# Altium schematic sheet Sheet1.SchDoc
size A3
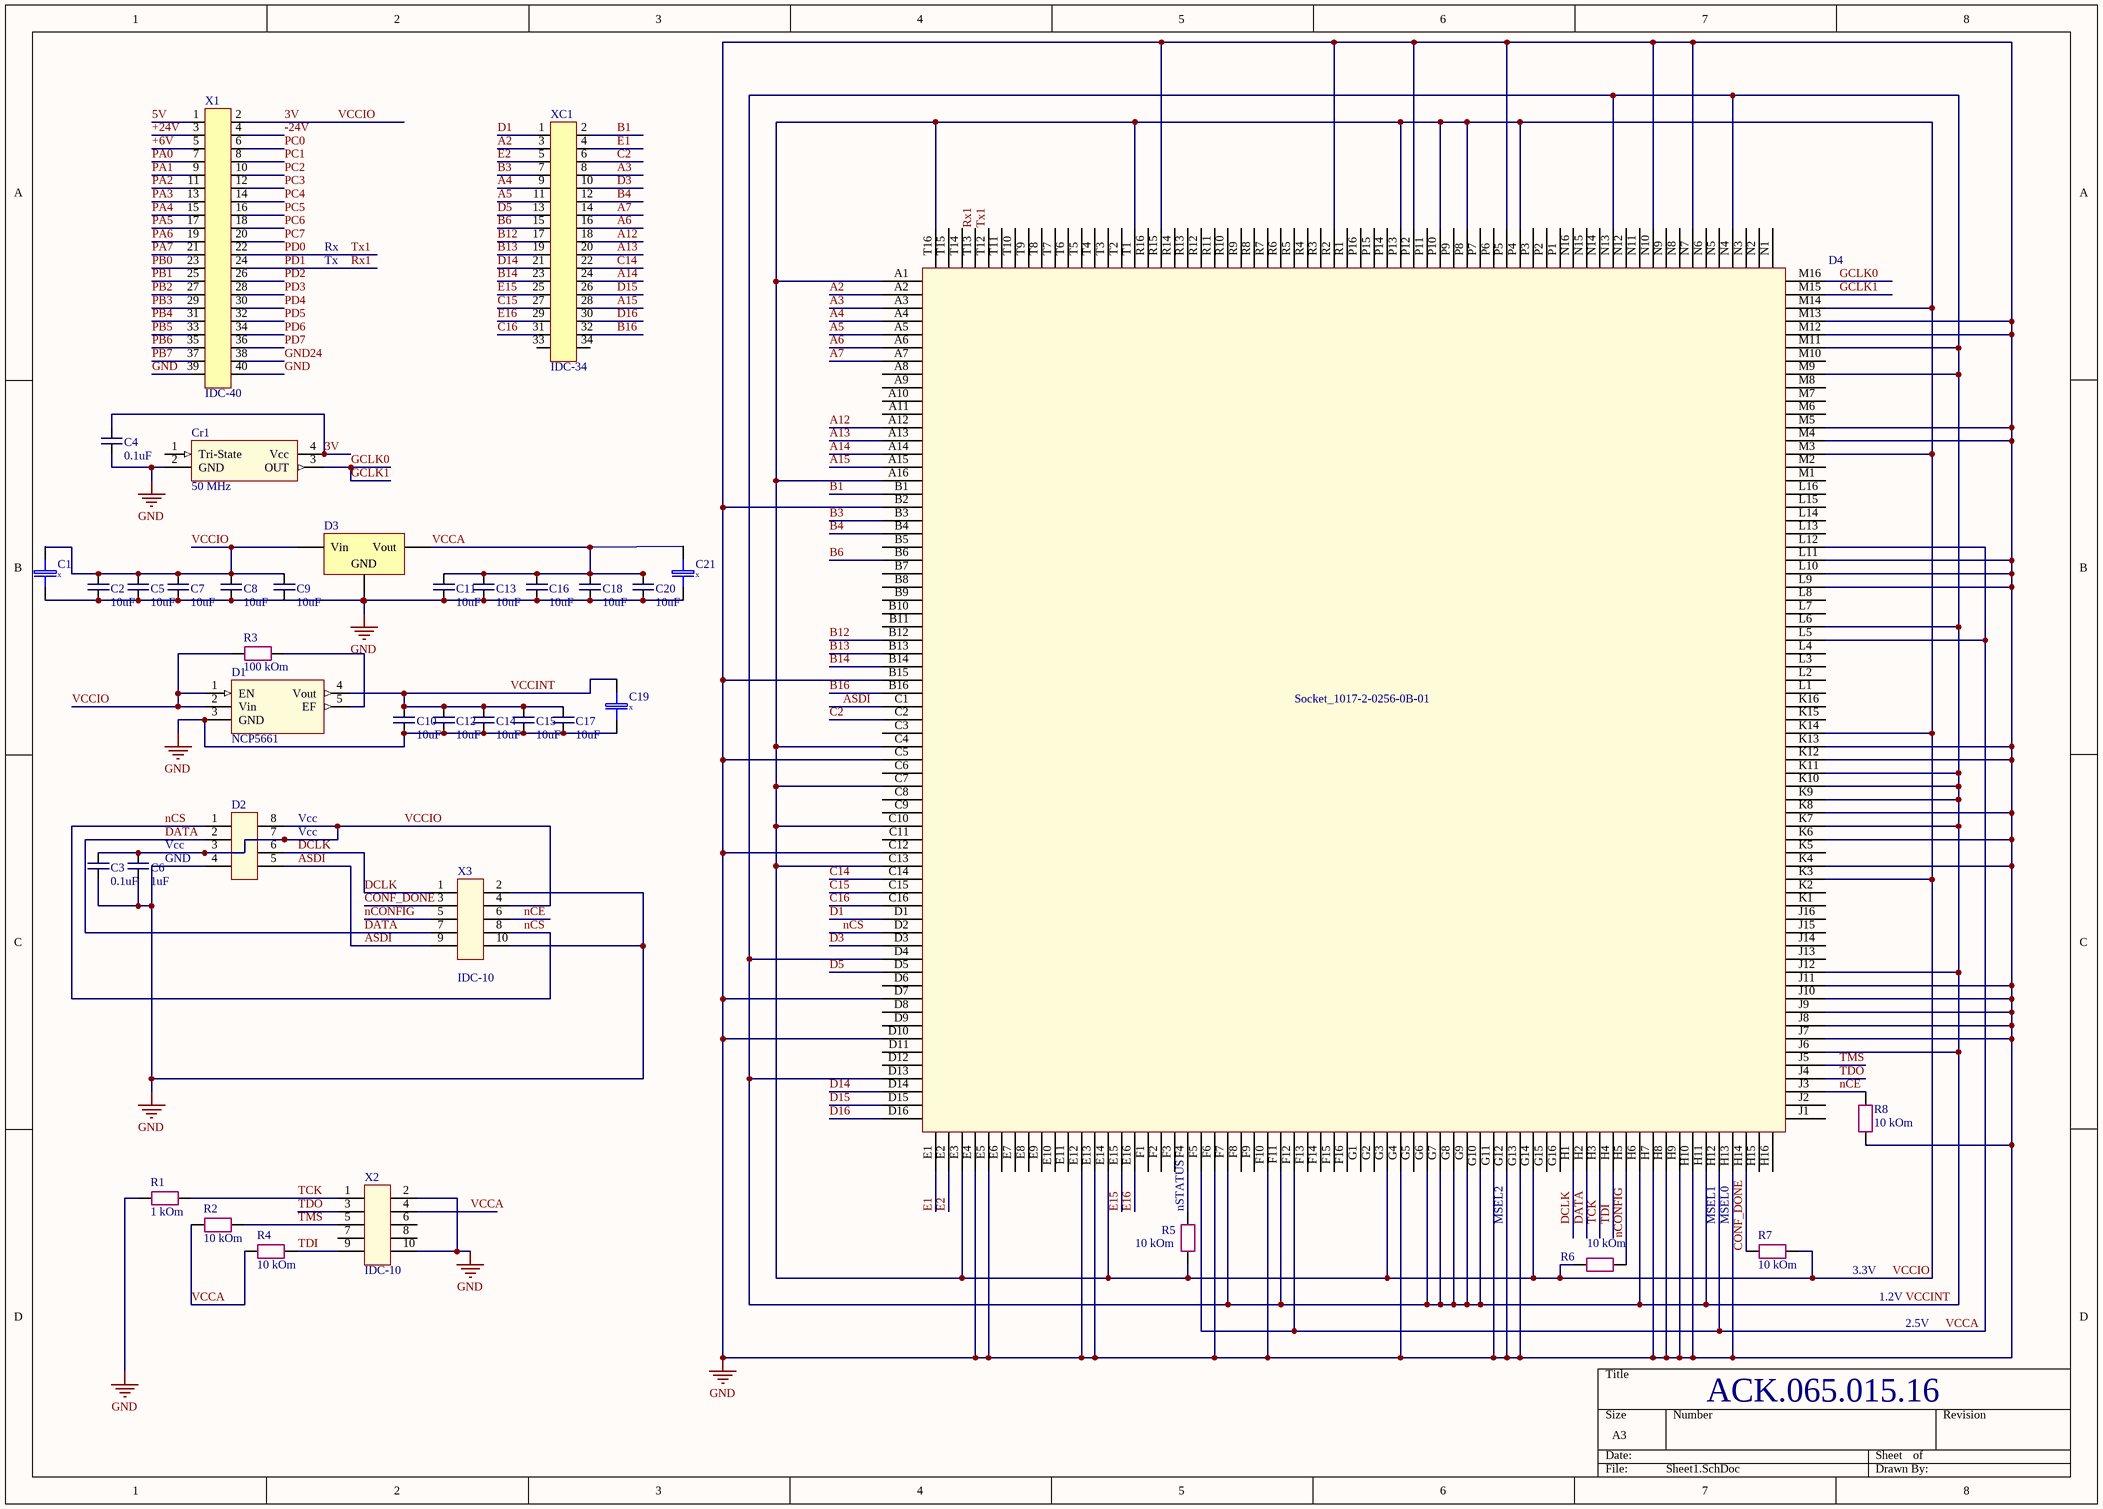
[diagram p0: Sheet1.SchDoc]

## Parts
C1  x  [EL Case D (7343-31)]
C2  10uF  [C_0805]
C3  0.1uF  [C_0805]
C4  0.1uF  [C_0805]
C5  10uF  [C_0805]
C6  1uF  [C_0805]
C7  10uF  [C_0805]
C8  10uF  [C_0805]
C9  10uF  [C_0805]
C10  10uF  [C_0805]
C11  10uF  [C_0805]
C12  10uF  [C_0805]
C13  10uF  [C_0805]
C14  10uF  [C_0805]
C15  10uF  [C_0805]
C16  10uF  [C_0805]
C17  10uF  [C_0805]
C18  10uF  [C_0805]
C19  x  [EL Case D (7343-31)]
C20  10uF  [C_0805]
C21  x  [EL Case D (7343-31)]
Cr1  50 MHz  [quartz gen smd 5032]
D1  NCP5661  [TO114P990-5_6M]
D2  SOIC-8  [SOIC-8]  (value not drawn)
D3  LM1117-3.3  [TO252AA]  (value not drawn)
D4  Socket_1017-2-0256-0B-01  [FBGA256]
R1  1 kOm  [R_0805]
R2  10 kOm  [R_0805]
R3  100 kOm  [R_0805]
R4  10 kOm  [R_0805]
R5  10 kOm  [R_0805]
R6  10 kOm  [R_0805]
R7  10 kOm  [R_0805]
R8  10 kOm  [R_0805]
X1  IDC-40  [IDC-40]
X2  IDC-10  [IDC-10]
X3  IDC-10  [IDC-10]
XC1  IDC-34  [IDC-34]

## Nets
GND: C1.2(-) C2.1 C3.1 C4.1 C5.1 C6.1 C7.1 C8.1 C9.1 C10.1 C11.1 C12.1 C13.1 C14.1 C15.1 C16.1 C17.1 C18.1 C19.2(-) C20.1 C21.2(-) Cr1.2(GND) D1.3(GND) D2.4 D3.2(GND) D4.B2 D4.B15 D4.C5 D4.C12 D4.D7 D4.D10 D4.E4 D4.E5 D4.E12 D4.E13 D4.F6 D4.F10 D4.G4 D4.G11 D4.G12 D4.G13 D4.H7 D4.H8 D4.H9 D4.H10 D4.H13 D4.J7 D4.J8 D4.J9 D4.J10 D4.J11 D4.K4 D4.K6 D4.K8 D4.K12 D4.K13 D4.L9 D4.L10 D4.L11 D4.M4 D4.M5 D4.M12 D4.M13 D4.N7 D4.N10 D4.P5 D4.P12 D4.R2 D4.R15 R1.1 R8.1 X1.39 X1.40 X2.2 X2.10 X3.2 X3.10
3V: C1.1(+) C2.2 C3.2 C4.2 C5.2 C6.2 C7.2 C8.2 C9.2 Cr1.4(Vcc) D1.1(EN) D1.2(Vin) D2.3 D2.7 D2.8 D3.1(Vin) D4.A1 D4.A16 D4.C4 D4.C7 D4.C10 D4.C13 D4.E3 D4.E14 D4.G3 D4.G14 D4.K3 D4.K14 D4.M3 D4.M14 D4.P4 D4.P8 D4.P10 D4.P13 D4.T1 D4.T16 R3.1 R5.2 R6.1 R7.2 X1.2 X3.4  [also labelled VCCIO]
5V: X1.1
+6V: X1.5
+24V: X1.3
-24V: X1.4
A2: D4.A2 XC1.3
A3: D4.A3 XC1.8
A4: D4.A4 XC1.9
A5: D4.A5 XC1.11
A6: D4.A6 XC1.16
A7: D4.A7 XC1.14
A12: D4.A12 XC1.18
A13: D4.A13 XC1.20
A14: D4.A14 XC1.24
A15: D4.A15 XC1.28
ASDI: D2.5 D4.C1 X3.9
B1: D4.B1 XC1.2
B3: D4.B3 XC1.7
B4: D4.B4 XC1.12
B6: D4.B6 XC1.15
B12: D4.B12 XC1.17
B13: D4.B13 XC1.19
B14: D4.B14 XC1.23
B16: D4.B16 XC1.32
C2: D4.C2 XC1.6
C14: D4.C14 XC1.22
C15: D4.C15 XC1.27
C16: D4.C16 XC1.31
CONF_DONE: D4.H14 R7.1 X3.3
D1: D4.D1 XC1.1
D3: D4.D3 XC1.10
D5: D4.D5 XC1.13
D14: D4.D14 XC1.21
D15: D4.D15 XC1.26
D16: D4.D16 XC1.30
DATA: D2.2 D4.H2 X3.7
DCLK: D2.6 D4.H1 X3.1
E1: D4.E1 XC1.4
E2: D4.E2 XC1.5
E15: D4.E15 XC1.25
E16: D4.E16 XC1.29
GCLK0: Cr1.3(OUT) D4.M15 D4.M16  [also labelled GCLK1]
GND24: X1.38
nCE: D4.J3 R8.2 X3.6
nCONFIG: D4.H5 R6.2 X3.5
nCS: D2.1 D4.D2 X3.8
PA0: X1.7
PA1: X1.9
PA2: X1.11
PA3: X1.13
PA4: X1.15
PA5: X1.17
PA6: X1.19
PA7: X1.21
PB0: X1.23
PB1: X1.25
PB2: X1.27
PB3: X1.29
PB4: X1.31
PB5: X1.33
PB6: X1.35
PB7: X1.37
PC0: X1.6
PC1: X1.8
PC2: X1.10
PC3: X1.12
PC4: X1.14
PC5: X1.16
PC6: X1.18
PC7: X1.20
PD0: D4.T12 X1.22  [also labelled Tx1]
PD1: D4.T13 X1.24  [also labelled Rx1]
PD2: X1.26
PD3: X1.28
PD4: X1.30
PD5: X1.32
PD6: X1.34
PD7: X1.36
TCK: D4.H3 R1.2 X2.1
TDI: D4.H4 R4.2 X2.9
TDO: D4.J4 X2.3
TMS: D4.J5 R2.2 X2.5
VCCA: C11.2 C13.2 C16.2 C18.2 C20.2 C21.1(+) D3.3(Vout) D4.F5 D4.F12 D4.H12 D4.L5 D4.L12 R2.1 R4.1 X2.4
VCCINT: C10.2 C12.2 C14.2 C15.2 C17.2 C19.1(+) D1.4(Vout) D4.D4 D4.D13 D4.F7 D4.F11 D4.G6 D4.G7 D4.G8 D4.G9 D4.G10 D4.H6 D4.H11 D4.J6 D4.J12 D4.K7 D4.K9 D4.K10 D4.K11 D4.L6 D4.M9 D4.M11 D4.N4 D4.N13
NetD1_5: D1.5(EF) R3.2
NetD4_F4: D4.F4 R5.1

Not connected (* = marked no-connect by the designer): Cr1 1(Tri-State); D4 A8 A9 A10 A11 B5 B7 B8 B9 B10 B11 C3 C6 C8 C9 C11 D6 D8 D9 D11 D12 E6 E7 E8 E9 E10 E11 F1 F2 F3 F8 F9 F13 F14 F15 F16 G1 G2 G5 G15 G16 H15 H16 J1 J2 J13 J14 J15 J16 K1 K2 K5 K15 K16 L1 L2 L3 L4 L7 L8 L13 L14 L15 L16 M1 M2 M6 M7 M8 M10 N1 N2 N3 N5 N6 N8 N9 N11 N12 N14 N15 N16 P1 P2 P3 P6 P7 P9 P11 P14 P15 P16 R1 R3 R4 R5 R6 R7 R8 R9 R10 R11 R12 R13 R14 R16 T2 T3 T4 T5 T6 T7 T8 T9 T10 T11 T14 T15; X2 6 7 8; XC1 33 34

## Notes on the sheet
- Rx
- Tx
- (near C6) Vcc
- (near D2) Vcc
- (near C6) GND
- (near R5) nSTATUS
- MSEL2
- MSEL1
- (near R7) MSEL0
- 3.3V
- 1.2V
- 2.5V
- ACK.065.015.16

## Library data of the parts
C1 C19 C21 = EL Case D (7343-31): EL Tantalum Case D (7343-31); Price: 0.60; Value: x
C2-C18 C20 = capacitor 0805
Cr1 = quartz gen 5032
D3 = Volt Reg: Voltage Regulator; Published: 24-Mar-1999; LatestRevisionDate: 29-May-2009; LatestRevisionNote: IPC-7351 Footprint Added.; PackageReference: D2PAK; Publisher: Altium Limited; PackageDescription: 3-Pin Transistor Outline Package 2.54 mm Pitch, 15.1 mm Lead Span
R1-R8 = resistor 0805
X1 = IDC-40: разъем 2529
X2 X3 = IDC-10: разъем 4130
XC1 = IDC-34: разъем 6556